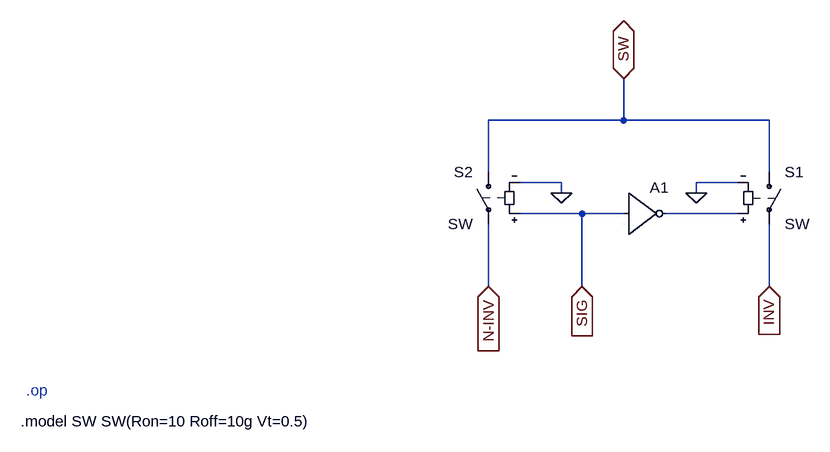
[diagram p0: schematic COM_SPDT.asc]
COM_SPDT.asc, the LTspice schematic file:
Version 4
SHEET 1 880 736
WIRE 48 256 48 192
WIRE 48 256 -160 256
WIRE 272 256 48 256
WIRE -160 336 -160 256
WIRE 272 336 272 256
WIRE -48 352 -112 352
WIRE 224 352 160 352
WIRE -48 368 -48 352
WIRE 160 368 160 352
WIRE -16 400 -112 400
WIRE 48 400 -16 400
WIRE 224 400 112 400
WIRE -160 512 -160 416
WIRE -16 512 -16 400
WIRE 272 512 272 416
FLAG 160 368 0
FLAG -48 368 0
FLAG 48 192 SW
IOPIN 48 192 BiDir
FLAG 272 512 INV
IOPIN 272 512 In
FLAG -160 512 N-INV
IOPIN -160 512 In
FLAG -16 512 SIG
IOPIN -16 512 In
SYMBOL sw 272 320 R0
SYMATTR InstName S1
SYMBOL Digital/inv 48 336 R0
SYMATTR InstName A1
SYMBOL sw -160 320 M0
SYMATTR InstName S2
TEXT -880 720 Left 2 !.model SW SW(Ron=10 Roff=10g Vt=0.5)
TEXT -872 672 Left 2 ;.op

The netlist it stands for:
* COM_SPDT.asc
S1 SW INV N001 0 SW
A1 SIG 0 0 0 0 N001 0 0 BUF
S2 SW N-INV SIG 0 SW
.model SW SW(Ron=10 Roff=10g Vt=0.5)
* .op
.backanno
.end